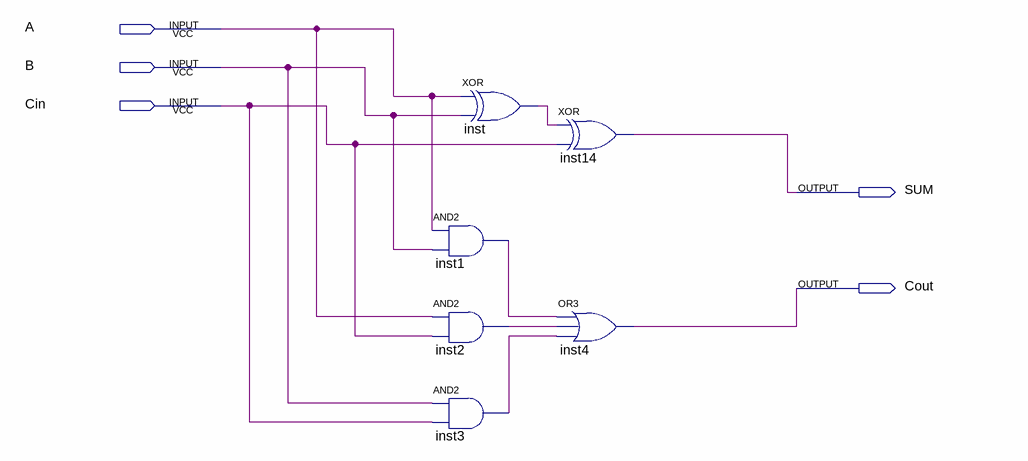
[diagram p0: schematic sheet]
// Quartus schematic fa.bdf as structural Verilog: 6 symbols, 5 pins
module fa (
  input  A,
  input  B,
  input  Cin,
  output SUM,
  output Cout
);

  wire inst1_out, inst2_out, inst3_out, inst_out;

  and inst1 (inst1_out, A, B);
  and inst2 (inst2_out, A, Cin);
  and inst3 (inst3_out, B, Cin);
  xor inst (inst_out, A, B);
  xor inst14 (SUM, inst_out, Cin);
  or inst4 (Cout, inst1_out, inst2_out, inst3_out);
endmodule
